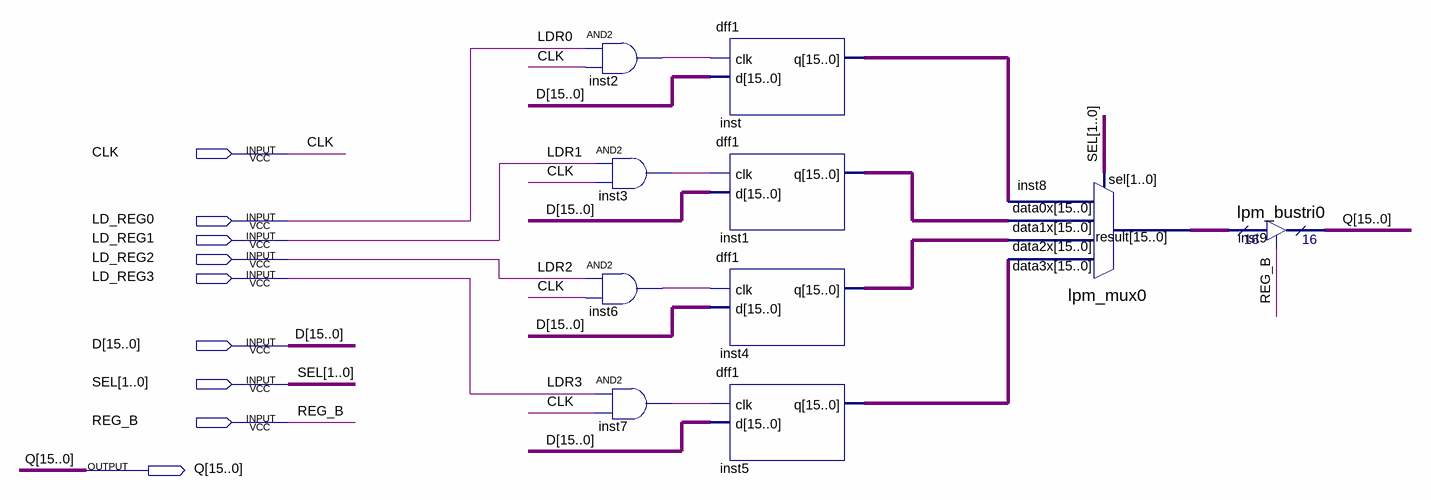
[diagram p0: schematic sheet]
// Quartus schematic reg.bdf as structural Verilog: 10 symbols, 9 pins
module \reg  (
  input  CLK,
  input  LD_REG0,
  input  LD_REG1,
  input  LD_REG2,
  input  LD_REG3,
  input  [15:0] D,
  input  [1:0] SEL,
  input  REG_B,
  output [15:0] Q
);

  wire inst2_out, inst3_out, inst6_out, inst7_out;
  wire [15:0] inst1_q, inst4_q, inst5_q, inst8_result, inst_q;

  and inst2 (inst2_out, LD_REG0, CLK);
  and inst3 (inst3_out, LD_REG1, CLK);
  and inst6 (inst6_out, LD_REG2, CLK);
  and inst7 (inst7_out, LD_REG3, CLK);
  dff1 inst (.clk(inst2_out), .d(D), .q(inst_q));
  dff1 inst1 (.clk(inst3_out), .d(D), .q(inst1_q));
  dff1 inst4 (.clk(inst6_out), .d(D), .q(inst4_q));
  dff1 inst5 (.clk(inst7_out), .d(D), .q(inst5_q));
  lpm_mux0 inst8 (
    .data3x(inst5_q), .data2x(inst4_q), .data1x(inst1_q), .data0x(inst_q), .sel(SEL), .result(inst8_result));
  lpm_bustri0 inst9 (.enabledt(REG_B), .data(inst8_result), .tridata(Q));

  // Other names for the same wires on the sheet: LDR0 = LD_REG0; LDR1 = LD_REG1; LDR2 = LD_REG2; LDR3 = LD_REG3
endmodule
